# EAGLE board Cubesat_Potencia-rev1 (EAGLE 7.2.0), part 1 of 2
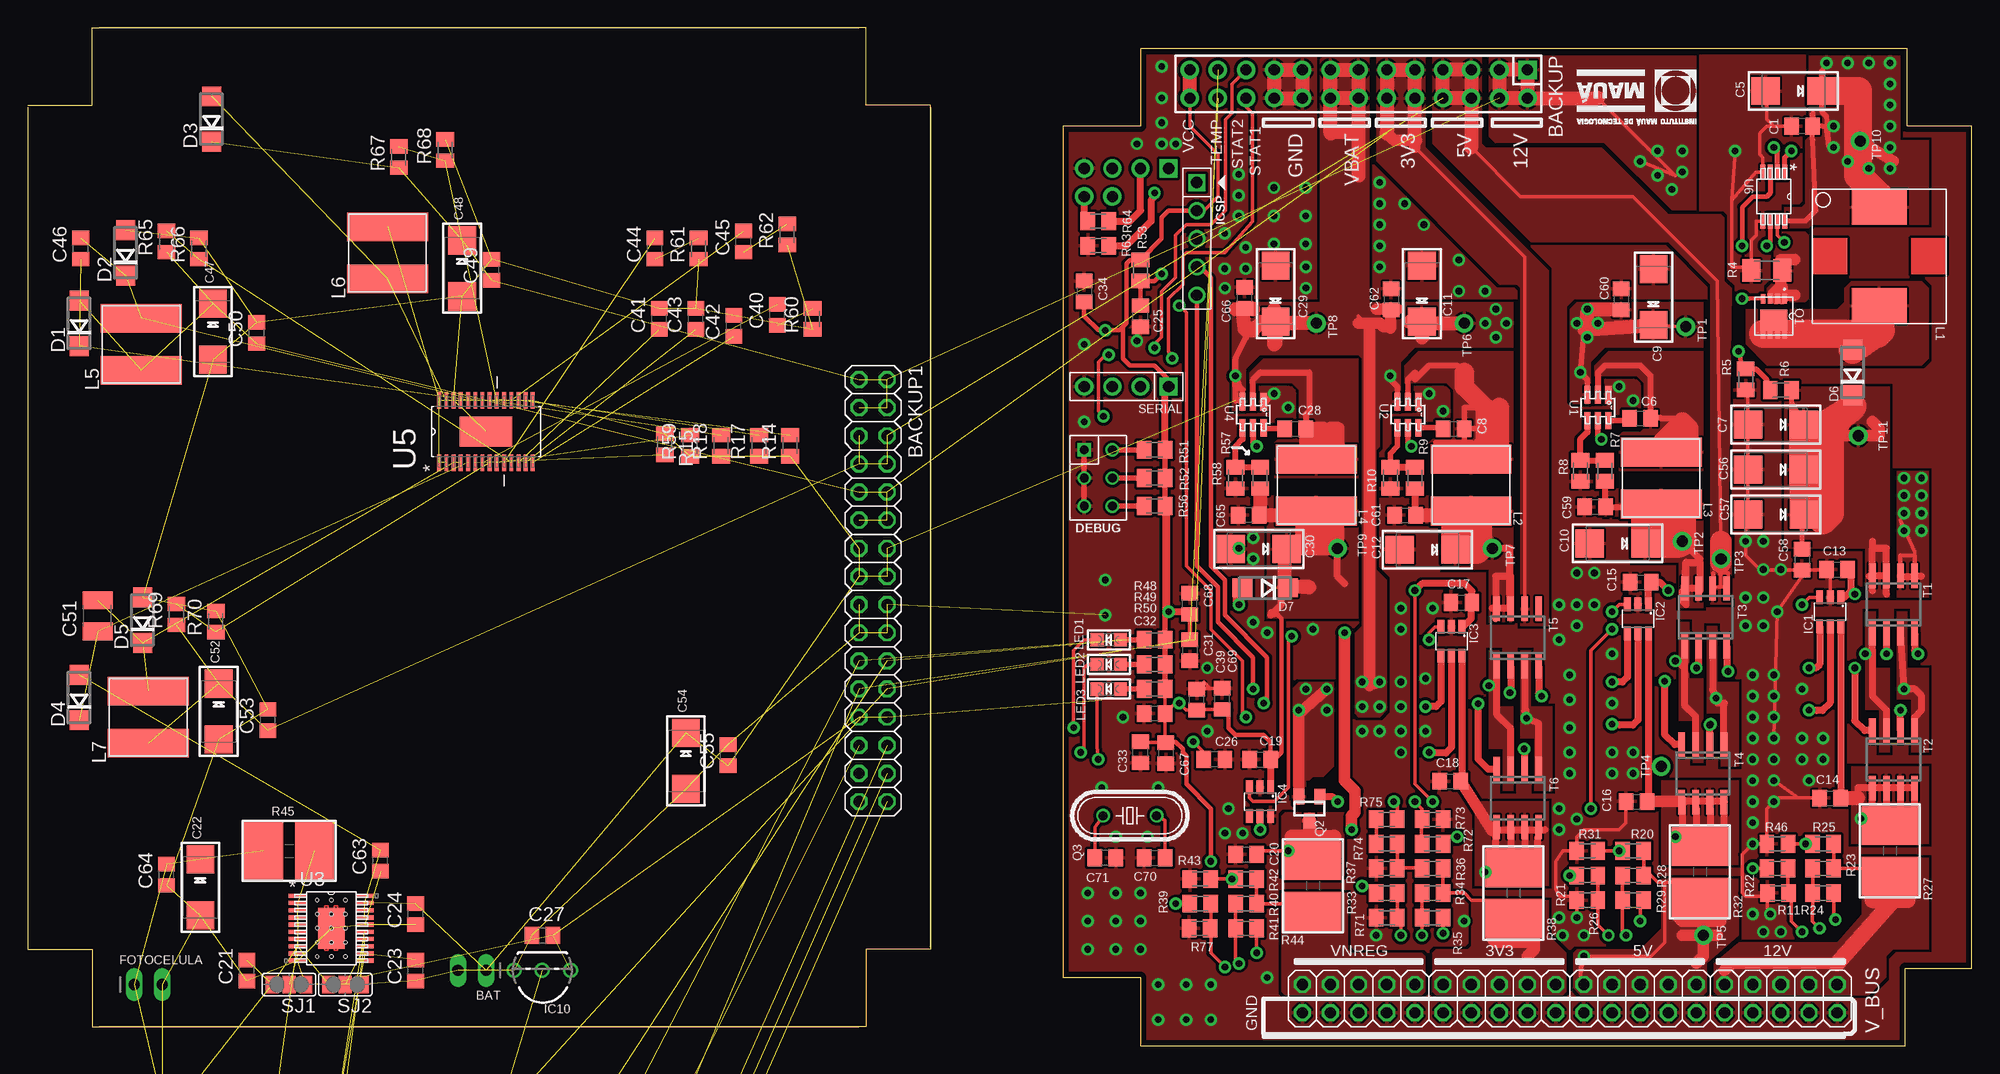
[diagram p11: board, top side]
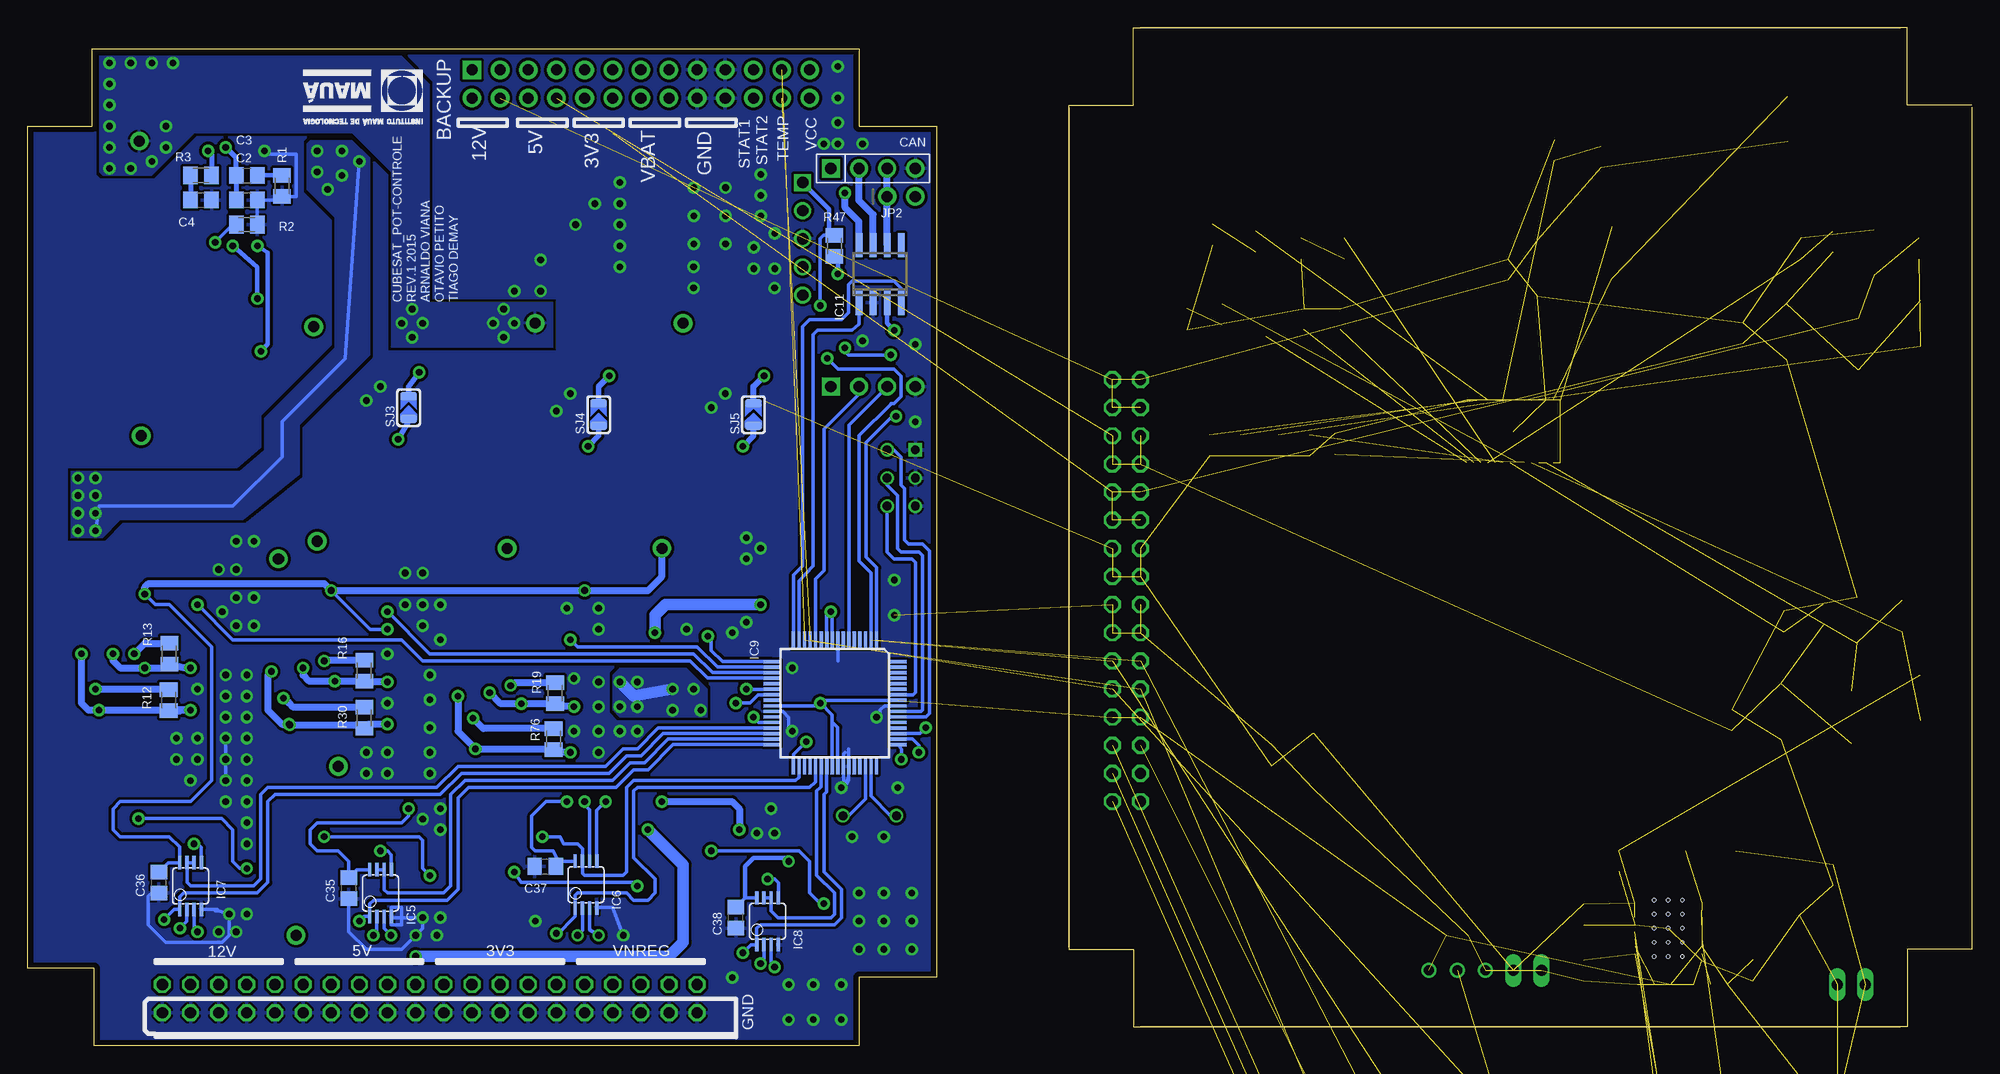
[diagram p12: board, bottom side, seen from below]

Size 175.43 x 91.91 mm. Coordinates in mm from the lower left corner, seen from the top.
Outline: 0,84.73 0,8.73 5.8,8.73 5.8,1.74 75,1.74
Outline: 81.45,84.73 81.45,8.73 75.65,8.73 75.65,1.74 6.45,1.74
Outline: 81.45,8.9 81.45,84.91 75.65,84.91 75.65,91.91 6.45,91.91
Outline: 0,84.91 5.8,84.91 5.8,91.91 75,91.91
Outline: 93.43,83 93.43,6.18 100.43,6.18 100.43,0 169.43,0 169.43,7 175.43,7 175.43,83 169.63,83 169.63,90 100.43,90 100.43,83 93.43,83
Copper layers (1*16): Top 0.035mm / dielectric 1.5mm / Bottom 0.035mm
Design rules "default": minimum track width 8mil, minimum drill 0.4mm, track to track 8mil, track to pad 8mil, pad to pad 8mil, via to via 8mil, smd to smd 8mil, copper to edge 20mil, drill to drill 8mil, minimum pad ring 8mil, minimum via ring 10mil, stop-mask expansion 3mil, vias tented up to drill 0mil, thermal gap 8mil

## Footprints (pad centres in the part's own frame; a part is rotated, then mirrored left to right if it is on the bottom)
1X05 = drill 1.016 long: 1 -5.08,0; 2 -2.54,0; 3 0,0; 4 2.54,0; 5 5.08,0
2X13 = drill 1 pad 1.676 square: 1 -15.24,-1.27 | drill 1 pad 1.676: 2 -15.24,1.27; 3 -12.7,-1.27; 4 -12.7,1.27; 5 -10.16,-1.27; 6 -10.16,1.27; 7 -7.62,-1.27; 8 -7.62,1.27; 9 -5.08,-1.27; 10 -5.08,1.27; 11 -2.54,-1.27; 12 -2.54,1.27; 13 0,-1.27; 14 0,1.27; 15 2.54,-1.27; 16 2.54,1.27; 17 5.08,-1.27; 18 5.08,1.27; 19 7.62,-1.27; 20 7.62,1.27; 21 10.16,-1.27; 22 10.16,1.27; 23 12.7,-1.27; 24 12.7,1.27; 25 15.24,-1.27; 26 15.24,1.27
2X16 = drill 1.016 octagon: 1 -19.05,-1.27; 2 -19.05,1.27; 3 -16.51,-1.27; 4 -16.51,1.27; 5 -13.97,-1.27; 6 -13.97,1.27; 7 -11.43,-1.27; 8 -11.43,1.27; 9 -8.89,-1.27; 10 -8.89,1.27; 11 -6.35,-1.27; 12 -6.35,1.27; 13 -3.81,-1.27; 14 -3.81,1.27; 15 -1.27,-1.27; 16 -1.27,1.27; 17 1.27,-1.27; 18 1.27,1.27; 19 3.81,-1.27; 20 3.81,1.27; 21 6.35,-1.27; 22 6.35,1.27; 23 8.89,-1.27; 24 8.89,1.27; 25 11.43,-1.27; 26 11.43,1.27; 27 13.97,-1.27; 28 13.97,1.27; 29 16.51,-1.27; 30 16.51,1.27; 31 19.05,-1.27; 32 19.05,1.27
1X02_OVAL = drill 1 long: 1 -1.27,0; 2 1.27,0
C0805 = smd 1.3 x 1.5: 1 -0.95,0; 2 0.95,0
EIA6032-28/C-R = smd 2.55 x 2.5: + 2.525,0; - -2.525,0
C1210 = smd 1.6 x 2.7: 1 -1.4,0; 2 1.4,0
M1X4 = drill 1.02 pad 1.632 square: 1 0,0 | drill 1.02 pad 1.632: 2 2.54,0; 3 5.08,0; 4 7.62,0
DO214AC = smd 1.8 x 1.7: A 2.05,0; C -2.05,0
M2X3 = drill 0.8 square: 1 -2.54,-1.27 | drill 0.8: 2 -2.54,1.27; 3 0,-1.27; 4 0,1.27; 5 2.54,-1.27; 6 2.54,1.27
TSOT23-6 = smd 0.62 x 1.22: 1 -0.95,-1.3; 2 0,-1.3; 3 0.95,-1.3; 4 0.95,1.3; 5 0,1.3; 6 -0.95,1.3
MSOP08 = smd 0.3 x 1.2: 1 -0.976,-2.113; 2 -0.326,-2.113; 3 0.324,-2.113; 4 0.974,-2.113; 5 0.974,2.112; 6 0.324,2.112; 7 -0.326,2.112; 8 -0.976,2.112
TQFP64-10X10X1MM = smd 1.5 x 0.3: 1 -5.7,3.75; 2 -5.7,3.25; 3 -5.7,2.75; 4 -5.7,2.25; 5 -5.7,1.75; 6 -5.7,1.25; 7 -5.7,0.75; 8 -5.7,0.25; 9 -5.7,-0.25; 10 -5.7,-0.75; 11 -5.7,-1.25; 12 -5.7,-1.75; 13 -5.7,-2.25; 14 -5.7,-2.75; 15 -5.7,-3.25; 16 -5.7,-3.75; 33 5.7,-3.75; 34 5.7,-3.25; 35 5.7,-2.75; 36 5.7,-2.25; 37 5.7,-1.75; 38 5.7,-1.25; 39 5.7,-0.75; 40 5.7,-0.25; 41 5.7,0.25; 42 5.7,0.75; 43 5.7,1.25; 44 5.7,1.75; 45 5.7,2.25; 46 5.7,2.75; 47 5.7,3.25; 48 5.7,3.75 | smd 0.3 x 1.5: 17 -3.75,-5.7; 18 -3.25,-5.7; 19 -2.75,-5.7; 20 -2.25,-5.7; 21 -1.75,-5.7; 22 -1.25,-5.7; 23 -0.75,-5.7; 24 -0.25,-5.7; 25 0.25,-5.7; 26 0.75,-5.7; 27 1.25,-5.7; 28 1.75,-5.7; 29 2.25,-5.7; 30 2.75,-5.7; 31 3.25,-5.7; 32 3.75,-5.7; 49 3.75,5.7; 50 3.25,5.7; 51 2.75,5.7; 52 2.25,5.7; 53 1.75,5.7; 54 1.25,5.7; 55 0.75,5.7; 56 0.25,5.7; 57 -0.25,5.7; 58 -0.75,5.7; 59 -1.25,5.7; 60 -1.75,5.7; 61 -2.25,5.7; 62 -2.75,5.7; 63 -3.25,5.7; 64 -3.75,5.7
TO92-LINE = drill 0.9: 1 -2.54,0; 2 0,0; 3 2.54,0
SO-08 = smd 0.6 x 2.2: 1 -1.905,-2.6; 2 -0.635,-2.6; 3 0.635,-2.6; 4 1.905,-2.6; 5 1.905,2.6; 6 0.635,2.6; 7 -0.635,2.6; 8 -1.905,2.6
SO16 = smd 0.66 x 2.032: 1 -4.445,-3.073; 2 -3.175,-3.073; 3 -1.905,-3.073; 4 -0.635,-3.073; 5 0.635,-3.073; 6 1.905,-3.073; 7 3.175,-3.073; 8 4.445,-3.073; 9 4.445,3.073; 10 3.175,3.073; 11 1.905,3.073; 12 0.635,3.073; 13 -0.635,3.073; 14 -1.905,3.073; 15 -3.175,3.073; 16 -4.445,3.073
HEADER_PRG_1X05_ICSP_B = drill 1.016 square: 1 -5.08,0 | drill 1.016: 2 -2.54,0; 3 0,0; 4 2.54,0; 5 5.08,0
1X02_ROUND = drill 1 pad 1.676: 1 -1.27,0; 2 1.27,0
SDR1307 = smd 4.95 x 3.135: 1 0,4.445; 2 0,-4.445
SRR6038 = smd 2.591 x 7.29: 1 -2.349,0; 2 2.349,0
CHIPLED_0805 = smd 1.2 x 1.2: A 0,-1.05; C 0,1.05
TRANS_NEXFET_Q3 = smd 0.864 x 0.406: 1 -1.575,0.975; 2 -1.575,0.325; 3 -1.575,-0.325; 4 -1.575,-0.975; 5 1.575,-0.975; 6 1.575,-0.325; 7 1.575,0.325; 8 1.575,0.975 | smd 1.905 x 2.438: 9 0.342,0
SUPER-SOT3 = smd 1 x 1.4: 1 -0.95,-1.1; 2 0.95,-1.1; 3 0,1.1
HC49/S = drill 0.813: 1 -2.413,0; 2 2.413,0
M0805 = smd 1.3 x 1.6: 1 -0.95,0; 2 0.95,0
M1206 = smd 1.6 x 2: 1 -1.4,0; 2 1.4,0
_2818 = smd 3.5 x 5.1: 1 -2.286,0; 2 2.286,0
TASCSOLARCELL = drill 0.8: N 1.5,3.5 | smd 1.5 x 1.5: P -2.6,5.1
SJ_2 = smd 1.168 x 1.6: 1 -1.524,0; 2 0,0; 3 1.524,0
SOLDERJUMPER_ARROW_NOPASTE = smd 0.762 x 1.524: 1 -1.016,0; 2 1.016,0
SO8 = smd 0.6 x 2.2: 1 -1.905,-2.6; 2 -0.635,-2.6; 3 0.635,-2.6; 4 1.905,-2.6; 5 1.905,2.6; 6 0.635,2.6; 7 -0.635,2.6; 8 -1.905,2.6
1X01_ROUND = drill 1 pad 1.676: 1 0,0
DDC0006A = smd 1.575 x 0.559: 1 -1.168,0.95; 2 -1.168,0; 3 -1.168,-0.95; 4 1.168,-0.95; 5 1.168,0; 6 1.168,0.95
PWP20_2P4X3P4-M = smd 1.6 x 0.37: 1 -3.023,2.921; 2 -3.023,2.286; 3 -3.023,1.626; 4 -3.023,0.965; 5 -3.023,0.33; 6 -3.023,-0.33; 7 -3.023,-0.965; 8 -3.023,-1.626; 9 -3.023,-2.286; 10 -3.023,-2.921; 11 3.023,-2.921; 12 3.023,-2.286; 13 3.023,-1.626; 14 3.023,-0.965; 15 3.023,-0.33; 16 3.023,0.33; 17 3.023,0.965; 18 3.023,1.626; 19 3.023,2.286; 20 3.023,2.921 | smd 2.4 x 3.7: 21 0,0 | hole 0.3: -1.27,2.54; 0,2.54; 1.27,2.54; -1.27,1.27; 0,1.27; 1.27,1.27; -1.27,0; 0,0; 1.27,0; -1.27,-1.27; 0,-1.27; 1.27,-1.27; -1.27,-2.54; 0,-2.54; 1.27,-2.54
SOP65P640X120-29N = smd 1.473 x 0.356: 1 -2.819,4.216; 2 -2.819,3.581; 3 -2.819,2.921; 4 -2.819,2.286; 5 -2.819,1.626; 6 -2.819,0.965; 7 -2.819,0.33; 8 -2.819,-0.33; 9 -2.819,-0.965; 10 -2.819,-1.626; 11 -2.819,-2.286; 12 -2.819,-2.921; 13 -2.819,-3.581; 14 -2.819,-4.216; 15 2.819,-4.216; 16 2.819,-3.581; 17 2.819,-2.921; 18 2.819,-2.286; 19 2.819,-1.626; 20 2.819,-0.965; 21 2.819,-0.33; 22 2.819,0.33; 23 2.819,0.965; 24 2.819,1.626; 25 2.819,2.286; 26 2.819,2.921; 27 2.819,3.581; 28 2.819,4.216 | smd 2.743 x 4.75: 29 0,0
MUA08A = smd 1.372 x 0.457: 1 -2.197,0.975; 2 -2.197,0.325; 3 -2.197,-0.325; 4 -2.197,-0.975; 5 2.197,-0.975; 6 2.197,-0.325; 7 2.197,0.325; 8 2.197,0.975
2X20 = drill 1.016 octagon: 1 -24.13,-1.27; 2 -24.13,1.27; 3 -21.59,-1.27; 4 -21.59,1.27; 5 -19.05,-1.27; 6 -19.05,1.27; 7 -16.51,-1.27; 8 -16.51,1.27; 9 -13.97,-1.27; 10 -13.97,1.27; 11 -11.43,-1.27; 12 -11.43,1.27; 13 -8.89,-1.27; 14 -8.89,1.27; 15 -6.35,-1.27; 16 -6.35,1.27; 17 -3.81,-1.27; 18 -3.81,1.27; 19 -1.27,-1.27; 20 -1.27,1.27; 21 1.27,-1.27; 22 1.27,1.27; 23 3.81,-1.27; 24 3.81,1.27; 25 6.35,-1.27; 26 6.35,1.27; 27 8.89,-1.27; 28 8.89,1.27; 29 11.43,-1.27; 30 11.43,1.27; 31 13.97,-1.27; 32 13.97,1.27; 33 16.51,-1.27; 34 16.51,1.27; 35 19.05,-1.27; 36 19.05,1.27; 37 21.59,-1.27; 38 21.59,1.27; 39 24.13,-1.27; 40 24.13,1.27
DF13A-8P = smd 0.7 x 2: 1 -4.375,0; 2 -3.125,0; 3 -1.875,0; 4 -0.625,0; 5 0.625,0; 6 1.875,0; 7 3.125,0; 8 4.375,0 | smd 1.6 x 2.2: P$1 -6.725,3.3; P$2 6.725,3.3

## Placement (x,y rotation side)
+X  +X  [1X05]  7.07,-13.51 0 top  (outside the outline)
+Y  +Y  [1X05]  7.07,-28.75 0 top  (outside the outline)
-X  -X  [1X05]  7.07,-21.12 0 top  (outside the outline)
-Y  -Y  [1X05]  7.07,-36.37 0 top  (outside the outline)
BACKUP  [2X13]  120.1,86.83 180 top
BACKUP1  [2X16]  76.29,41.1 270 top
BAT  [1X02_OVAL]  40.09,6.82 180 top
C1  100nF  [C0805]  160.11,83.02 180 top
C2  2.2nF  [C0805]  155.66,76.35 0 bottom
C3  47nF  [C0805]  155.66,78.57 0 bottom
C4  10nF  [C0805]  159.79,76.35 0 bottom
C5  47uF  [EIA6032-28/C-R]  159.34,86.19 0 top
C6  100nF  [C0805]  145.5,56.66 0 top
C7  47uF  [EIA6032-28/C-R]  157.76,56.09 0 top
C8  100nF  [C0805]  128.67,55.71 0 top
C9  22uF  [EIA6032-28/C-R]  146.71,67.58 270 top
C10  47uF  [EIA6032-28/C-R]  143.47,45.36 0 top
C11  22uF  [EIA6032-28/C-R]  125.81,67.9 270 top
C12  47uF  [EIA6032-28/C-R]  126.32,44.79 0 top
C13  100nF  [C0805]  163.28,43.01 0 top
C14  100nF  [C0805]  162.65,22.37 0 top
C15  100nF  [C0805]  145.56,41.87 0 top
C16  100nF  [C0805]  145.18,22.05 0 top
C17  100nF  [C0805]  129.37,40.03 0 top
C18  100nF  [C0805]  128.36,23.9 0 top
C19  100nF  [C0805]  111.21,25.86 0 top
C20  100nF  [C0805]  109.94,17.29 0 top
C21  100nF  [C0805]  19.77,6.82 90 top
C22  22uF  [EIA6032-28/C-R]  15.58,14.31 90 top
C23  220nF  [C0805]  35.01,6.82 90 top
C24  1uF  [C0805]  35.01,11.89 90 top
C25  100nF  [C0805]  100.42,65.87 90 top
C26  10uF  [C0805]  107.08,25.86 180 top
C27  100nF  [C0805]  46.44,9.99 0 top
C28  100nF  [C0805]  114.39,55.71 0 top
C29  22uF  [EIA6032-28/C-R]  112.61,67.9 270 top
C30  47uF  [EIA6032-28/C-R]  111.08,44.85 0 top
C31  100nF  [C0805]  104.86,35.71 270 top
C32  100nF  [C0805]  101.69,29.99 180 top
C33  100nF  [C0805]  100.42,26.5 90 top
C34  100nF  [C0805]  95.34,68.09 270 top
C35  100nF  [C0805]  146.45,14.24 90 bottom
C36  100nF  [C0805]  163.6,14.75 90 bottom
C37  100nF  [C0805]  128.74,16.21 0 bottom
C38  100nF  [C0805]  111.53,11.58 90 bottom
C39  100nF  [C0805]  105.5,31.26 90 top
C40  3300pF  [C0805]  67.65,66 90 top
C41  1500pF  [C0805]  56.98,65.62 90 top
C42  1500pF  [C0805]  63.71,64.98 90 top
C43  1500pF  [C0805]  60.28,65.62 90 top
C44  1000pF  [C0805]  56.6,71.97 90 top
C45  0.022uF  [C0805]  64.6,72.6 90 top
C46  100nF  [C0805]  4.78,71.97 90 top
C47  22uF  [EIA6032-28/C-R]  16.72,64.47 90 top
C48  22uF  [EIA6032-28/C-R]  39.2,70.19 90 top
C49  100nF  [C0805]  41.87,70.06 90 top
C50  100nF  [C0805]  20.66,64.35 90 top
C51  100nF  [C1210]  6.31,38.82 90 top
C52  22uF  [EIA6032-28/C-R]  17.23,30.18 90 top
C53  100nF  [C0805]  21.68,29.42 90 top
C54  22uF  [EIA6032-28/C-R]  59.39,25.74 90 top
C55  100nF  [C0805]  63.2,26.25 90 top
C56  47uF  [EIA6032-28/C-R]  157.76,52.03 0 top
C57  47uF  [EIA6032-28/C-R]  157.76,47.96 0 top
C58  100nF  [C0805]  160.11,43.9 270 top
C59  100nF  [C0805]  141.44,48.66 0 top
C60  100nF  [C0805]  143.79,67.39 270 top
C61  100nF  [C0805]  124.29,47.9 0 top
C62  100nF  [C0805]  123.02,67.39 270 top
C63  100nF  [C0805]  31.84,16.72 90 top
C64  100nF  [C0805]  12.53,15.45 90 top
C65  100nF  [C0805]  110.19,47.9 180 top
C66  100nF  [C0805]  109.81,67.52 90 top
C67  10uF  [C0805]  102.7,26.44 270 top
C68  10uF  [C0805]  104.86,39.9 90 top
C69  10uF  [C0805]  107.78,31.33 90 top
C70  27pF  [C0805]  101.69,16.97 0 top
C71  27pF  [C0805]  97.24,16.97 180 top
C72  100nF  [C0805]  12.15,-52.88 0 top  (outside the outline)
C73  100nF  [C0805]  19.14,-52.88 0 top  (outside the outline)
C74  100nF  [C0805]  2.62,-60.5 0 top  (outside the outline)
C75  100nF  [C0805]  2.62,-90.34 0 top  (outside the outline)
C76  100nF  [C0805]  9.61,-90.34 0 top  (outside the outline)
C77  100nF  [C0805]  2.62,-113.84 0 top  (outside the outline)
C78  100nF  [C0805]  9.61,-113.84 0 top  (outside the outline)
C79  100nF  [C0805]  2.62,-120.19 0 top  (outside the outline)
C80  100nF  [C0805]  9.61,-120.19 0 top  (outside the outline)
C81  100nF  [C0805]  2.62,-346.88 0 top  (outside the outline)
CAN  CON_HEADER_1X04  [M1X4]  102.96,79.2 0 bottom
D1  B340A-13-F  [DO214AC]  4.66,65.23 90 top
D2  B340A-13-F  [DO214AC]  8.85,71.58 90 top
D3  B340A-13-F  [DO214AC]  16.6,83.65 90 top
D4  B340A-13-F  [DO214AC]  4.66,31.45 90 top
D5  B340A-13-F  [DO214AC]  10.37,38.44 90 top
D6  B340A-13-F  [DO214AC]  164.68,60.79 90 top
D7  B340A-13-F  [DO214AC]  111.65,41.36 180 top
D8  B340A-13-F  [DO214AC]  3.26,-353.23 0 top  (outside the outline)
D9  B340A-13-F  [DO214AC]  3.26,-359.58 0 top  (outside the outline)
D10  B340A-13-F  [DO214AC]  3.26,-365.93 0 top  (outside the outline)
D11  B340A-13-F  [DO214AC]  3.26,-372.28 0 top  (outside the outline)
D12  B340A-13-F  [DO214AC]  3.26,-378.63 0 top  (outside the outline)
D13  B340A-13-F  [DO214AC]  3.26,-384.98 0 top  (outside the outline)
DEBUG  CON_HEADER_2X03-PTH  [M2X3]  96.61,51.27 270 top
FOTOCELULA  [1X02_OVAL]  10.88,5.54 0 top
IC1  LTC4412HV  [TSOT23-6]  162.65,39.2 180 top
IC2  LTC4412HV  [TSOT23-6]  145.31,38.56 180 top
IC3  LTC4412HV  [TSOT23-6]  128.48,36.53 180 top
IC4  LTC4412HV  [TSOT23-6]  111.21,22.05 180 top
IC5  LMP2012  [MSOP08]  143.59,13.8 0 bottom
IC6  LMP2012  [MSOP08]  125.05,14.56 0 bottom
IC7  LMP2012  [MSOP08]  160.74,14.44 0 bottom
IC8  LMP2012  [MSOP08]  108.67,11.26 0 bottom
IC9  PIC18F66K80  [TQFP64-10X10X1MM]  102.58,30.95 270 bottom
IC10  TMP35B  [TO92-LINE]  46.44,6.82 180 top
IC11  MCP2551  [SO-08]  98.51,69.68 0 bottom
IC12  LTC4412HV  [TSOT23-6]  3.26,-47.16 0 top  (outside the outline)
IC13  LMP2012  [MSOP08]  10.88,-46.52 0 top  (outside the outline)
IC14  LTC4412HV  [TSOT23-6]  3.26,-77 0 top  (outside the outline)
IC15  LTC4412HV  [TSOT23-6]  3.26,-100.5 0 top  (outside the outline)
IC16  LTC4412HV  [TSOT23-6]  9.61,-100.5 0 top  (outside the outline)
IC17  4051D  [SO16]  7.71,-128.44 0 top  (outside the outline)
IC18  TMP35B  [TO92-LINE]  3.9,-340.53 0 top  (outside the outline)
ICSP  CON_HEADER_PRG_PIC_ICSP0.1INCH_B  [HEADER_PRG_1X05_ICSP_B]  105.5,72.86 270 top
JP2  [1X02_ROUND]  96.61,76.66 0 bottom
L1  33uH  [SDR1307]  167.09,71.27 0 top
L2  2.2uH  [SRR6038]  130.26,50.63 270 top
L3  3.3uH  [SRR6038]  147.41,51.27 270 top
L4  3.3uH  [SRR6038]  116.29,50.63 270 top
L5  3.3uH  [SRR6038]  10.25,63.33 90 top
L6  10uH  [SRR6038]  32.47,71.58 90 top
L7  3.3uH  [SRR6038]  10.88,29.67 90 top
LED1  GREEN  [CHIPLED_0805]  97.56,36.66 90 top
LED2  GREEN  [CHIPLED_0805]  97.56,34.44 90 top
LED3  GREEN  [CHIPLED_0805]  97.56,32.21 90 top
LED4  GREEN  [CHIPLED_0805]  2.62,-168.44 0 top  (outside the outline)
LED5  GREEN  [CHIPLED_0805]  7.07,-168.44 0 top  (outside the outline)
Q1  CSD16323Q3  [TRANS_NEXFET_Q3]  157.56,65.87 270 top
Q2  FDN360P  [SUPER-SOT3]  115.66,21.42 180 top
Q3  4MHz  [HC49/S]  99.46,20.78 180 top
Q4  FDN360P  [SUPER-SOT3]  2.62,-53.51 0 top  (outside the outline)
Q5  FDN360P  [SUPER-SOT3]  2.62,-83.36 0 top  (outside the outline)
Q6  FDN360P  [SUPER-SOT3]  2.62,-106.85 0 top  (outside the outline)
Q7  FDN360P  [SUPER-SOT3]  12.15,-106.85 0 top  (outside the outline)
R1  3.4k  [M0805]  152.49,77.62 90 bottom
R2  71.5k  [M0805]  155.66,74.12 180 bottom
R3  100  [M0805]  159.79,78.57 0 bottom
R4  0.033R  [M1206]  156.93,70 0 top
R5  1k  [M0805]  155.03,60.16 90 top
R6  8.45k  [M0805]  158.2,59.2 180 top
R7  56.2k  [M0805]  142.33,51.9 270 top
R8  10k  [M0805]  140.1,51.9 90 top
R9  33.2k  [M0805]  125.18,51.27 270 top
R10  10k  [M0805]  122.96,51.27 90 top
R11  220k  [M0805]  157.95,13.8 0 top
R12  680k  [M0805]  162.71,31.2 270 bottom
R13  680k  [M0805]  162.65,35.39 270 bottom
R14  100k  [M0805]  68.79,54.19 90 top
R15  100k  [M0805]  57.49,54.31 270 top
R16  680k  [M0805]  145.06,33.87 270 bottom
R17  100k  [M0805]  66,54.19 90 top
R18  100k  [M0805]  62.57,54.19 90 top
R19  680k  [M0805]  127.85,31.83 270 bottom
R20  1k5  [M0805]  144.87,17.61 180 top
R21  22k  [M0805]  140.74,15.39 180 top
R22  22k  [M0805]  157.88,16.02 180 top
R23  22k  [M0805]  162.01,16.02 0 top
R24  220k  [M0805]  162.01,13.8 180 top
R25  33.2k  [M0805]  162.01,18.24 180 top
R26  220k  [M0805]  140.74,13.17 180 top
R27  0.1R  [_2818]  168.04,17.61 270 top
R28  22k  [M0805]  144.87,15.39 0 top
R29  220k  [M0805]  144.87,13.17 180 top
R30  680k  [M0805]  145.06,29.61 270 bottom
R31  10k  [M0805]  140.74,17.61 180 top
R32  0.1R  [_2818]  150.9,15.71 270 top
R33  22k  [M0805]  122.64,13.8 180 top
R34  22k  [M0805]  126.77,13.8 0 top
R35  220k  [M0805]  126.77,11.58 180 top
R36  10k  [M0805]  126.77,16.02 180 top
R37  10k  [M0805]  122.64,16.02 180 top
R38  0.1R  [_2818]  134.07,13.8 270 top
R39  22k  [M0805]  105.81,12.85 180 top
R40  22k  [M0805]  109.94,12.85 0 top
R41  220k  [M0805]  109.94,10.62 180 top
R42  10k  [M0805]  109.94,15.07 180 top
R43  10k  [M0805]  105.81,15.07 180 top
R44  0.1R  [_2818]  115.97,14.44 270 top
R45  0.1R  [_2818]  23.58,17.61 0 top
R46  22k  [M0805]  157.88,18.24 180 top
R47  470R  [M0805]  102.64,72.22 90 bottom
R48  470R  [M0805]  101.69,36.66 180 top
R49  470R  [M0805]  101.69,34.44 180 top
R50  470R  [M0805]  101.69,32.21 180 top
R51  10k  [M0805]  101.69,53.8 0 top
R52  10k  [M0805]  101.69,51.27 0 top
R53  10k  [M0805]  100.42,70 270 top
R54  22k  [M0805]  21.04,-60.5 0 top  (outside the outline)
R55  22k  [M0805]  2.62,-66.84 0 top  (outside the outline)
R56  10k  [M0805]  101.69,48.73 0 top
R57  56.2k  [M0805]  111.21,51.27 270 top
R58  10k  [M0805]  108.99,51.27 90 top
R59  100k  [M0805]  59.78,54.19 90 top
R60  2k2  [M0805]  70.82,65.62 90 top
R61  10k  [M0805]  60.54,71.97 90 top
R62  1k5  [M0805]  68.54,73.24 90 top
R63  [M0805]  96.61,72.22 0 top
R64  120R  [M0805]  96.61,74.44 0 top
R65  10k7  [M0805]  12.53,72.6 90 top
R66  2k49  [M0805]  15.45,71.97 90 top
R67  115k  [M0805]  33.49,80.22 90 top
R68  13k3  [M0805]  37.68,80.86 90 top
R69  17K4  [M0805]  13.42,38.95 90 top
R70  2k49  [M0805]  16.98,38.31 90 top
R71  220k  [M0805]  122.64,11.58 180 top
R72  17.4k  [M0805]  126.77,18.24 0 top
R73  10k  [M0805]  126.77,20.47 180 top
R74  3.4k  [M0805]  122.64,18.24 180 top
R75  3.4k  [M0805]  122.64,20.47 0 top
R76  680k  [M0805]  127.97,27.71 270 bottom
R77  220k  [M0805]  105.75,10.62 180 top
R78  220k  [M0805]  9.61,-60.5 0 top  (outside the outline)
R79  10k  [M0805]  7.71,-66.84 0 top  (outside the outline)
R80  10k  [M0805]  12.79,-66.84 0 top  (outside the outline)
R81  220k  [M0805]  15.33,-60.5 0 top  (outside the outline)
R82  0.1R  [_2818]  19.14,-44.62 0 top  (outside the outline)
R83  40k  [M0805]  2.62,-144.31 0 top  (outside the outline)
R84  11.5k  [M0805]  2.62,-150.66 0 top  (outside the outline)
R85  470R  [M0805]  2.62,-157.01 0 top  (outside the outline)
R86  470R  [M0805]  2.62,-163.36 0 top  (outside the outline)
S1  TASCSOLARCELL  [TASCSOLARCELL]  26.76,-181.14 0 top  (outside the outline)
S2  TASCSOLARCELL  [TASCSOLARCELL]  71.21,-181.14 0 top  (outside the outline)
S3  TASCSOLARCELL  [TASCSOLARCELL]  26.76,-193.84 0 top  (outside the outline)
S4  TASCSOLARCELL  [TASCSOLARCELL]  71.21,-193.84 0 top  (outside the outline)
S5  TASCSOLARCELL  [TASCSOLARCELL]  26.76,-206.54 0 top  (outside the outline)
S6  TASCSOLARCELL  [TASCSOLARCELL]  71.21,-206.54 0 top  (outside the outline)
S7  TASCSOLARCELL  [TASCSOLARCELL]  26.76,-219.24 0 top  (outside the outline)
S8  TASCSOLARCELL  [TASCSOLARCELL]  71.21,-219.24 0 top  (outside the outline)
S9  TASCSOLARCELL  [TASCSOLARCELL]  26.76,-231.94 0 top  (outside the outline)
S10  TASCSOLARCELL  [TASCSOLARCELL]  71.21,-231.94 0 top  (outside the outline)
S11  TASCSOLARCELL  [TASCSOLARCELL]  26.76,-244.64 0 top  (outside the outline)
S12  TASCSOLARCELL  [TASCSOLARCELL]  71.21,-244.64 0 top  (outside the outline)
S13  TASCSOLARCELL  [TASCSOLARCELL]  26.76,-257.35 0 top  (outside the outline)
S14  TASCSOLARCELL  [TASCSOLARCELL]  71.21,-257.35 0 top  (outside the outline)
S15  TASCSOLARCELL  [TASCSOLARCELL]  26.76,-270.05 0 top  (outside the outline)
S16  TASCSOLARCELL  [TASCSOLARCELL]  71.21,-270.05 0 top  (outside the outline)
S17  TASCSOLARCELL  [TASCSOLARCELL]  26.76,-282.75 0 top  (outside the outline)
S18  TASCSOLARCELL  [TASCSOLARCELL]  71.21,-282.75 0 top  (outside the outline)
S19  TASCSOLARCELL  [TASCSOLARCELL]  26.76,-295.44 0 top  (outside the outline)
S20  TASCSOLARCELL  [TASCSOLARCELL]  71.21,-295.44 0 top  (outside the outline)
S21  TASCSOLARCELL  [TASCSOLARCELL]  26.76,-308.15 0 top  (outside the outline)
S22  TASCSOLARCELL  [TASCSOLARCELL]  71.21,-308.15 0 top  (outside the outline)
S23  TASCSOLARCELL  [TASCSOLARCELL]  26.76,-320.85 0 top  (outside the outline)
S24  TASCSOLARCELL  [TASCSOLARCELL]  71.21,-320.85 0 top  (outside the outline)
SERIAL  CON_HEADER_1X04  [M1X4]  102.96,59.52 180 top
SJ1  VSEL  [SJ_2]  23.58,5.54 180 top
SJ2  TMRSEL  [SJ_2]  28.66,5.54 180 top
SJ3  [SOLDERJUMPER_ARROW_NOPASTE]  141.06,57.61 90 bottom
SJ4  [SOLDERJUMPER_ARROW_NOPASTE]  123.91,56.98 90 bottom
SJ5  [SOLDERJUMPER_ARROW_NOPASTE]  109.94,56.98 90 bottom
SJ6  VSEL  [SJ_2]  3.26,-136.06 0 top  (outside the outline)
SJ7  [SOLDERJUMPER_ARROW_NOPASTE]  2.62,-139.87 0 top  (outside the outline)
T1  Si9933CDY  [SO8]  168.36,39.84 0 top
T2  Si9933CDY  [SO8]  168.36,25.86 180 top
T3  Si9933CDY  [SO8]  151.41,38.69 0 top
T4  Si9933CDY  [SO8]  151.15,24.59 180 top
T5  Si9933CDY  [SO8]  134.45,36.85 0 top
T6  Si9933CDY  [SO8]  134.45,22.37 180 top
TP1  [1X01_ROUND]  149.63,64.92 270 top
TP2  [1X01_ROUND]  149.31,45.55 270 top
TP3  [1X01_ROUND]  152.8,43.96 270 top
TP4  [1X01_ROUND]  147.41,25.23 270 top
TP5  [1X01_ROUND]  151.22,9.99 270 top
TP6  [1X01_ROUND]  129.62,65.23 270 top
TP7  [1X01_ROUND]  132.17,44.91 270 top
TP8  [1X01_ROUND]  116.29,65.23 270 top
TP9  [1X01_ROUND]  118.2,44.91 270 top
TP10  [1X01_ROUND]  165.36,81.67 270 top
TP11  [1X01_ROUND]  165.19,55.07 270 top
U1  TPS563200DDCR  [DDC0006A]  141.69,57.61 270 top
U2  TPS563200DDCR  [DDC0006A]  124.55,56.98 270 top
U3  BQ24005_PWP_20C  [PWP20_2P4X3P4-M]  27.39,10.62 0 top
U4  TPS563200DDCR  [DDC0006A]  110.58,56.98 270 top
U5  LT1941EFEPBF  [SOP65P640X120-29N]  41.36,55.46 90 top
U6  LM3488MM/NOPB  [MUA08A]  157.56,76.66 270 top
U$112  [LOGO_MAUA]  150.58,88.09 180 top
U$113  [LOGO_MAUA]  139.78,88.09 180 bottom
V_BUS  V_BUS  [2X20]  139.15,4.28 180 top
X1  DF13DF13A-8P-1.25H  [DF13A-8P]  96.61,-319.57 0 top  (outside the outline)